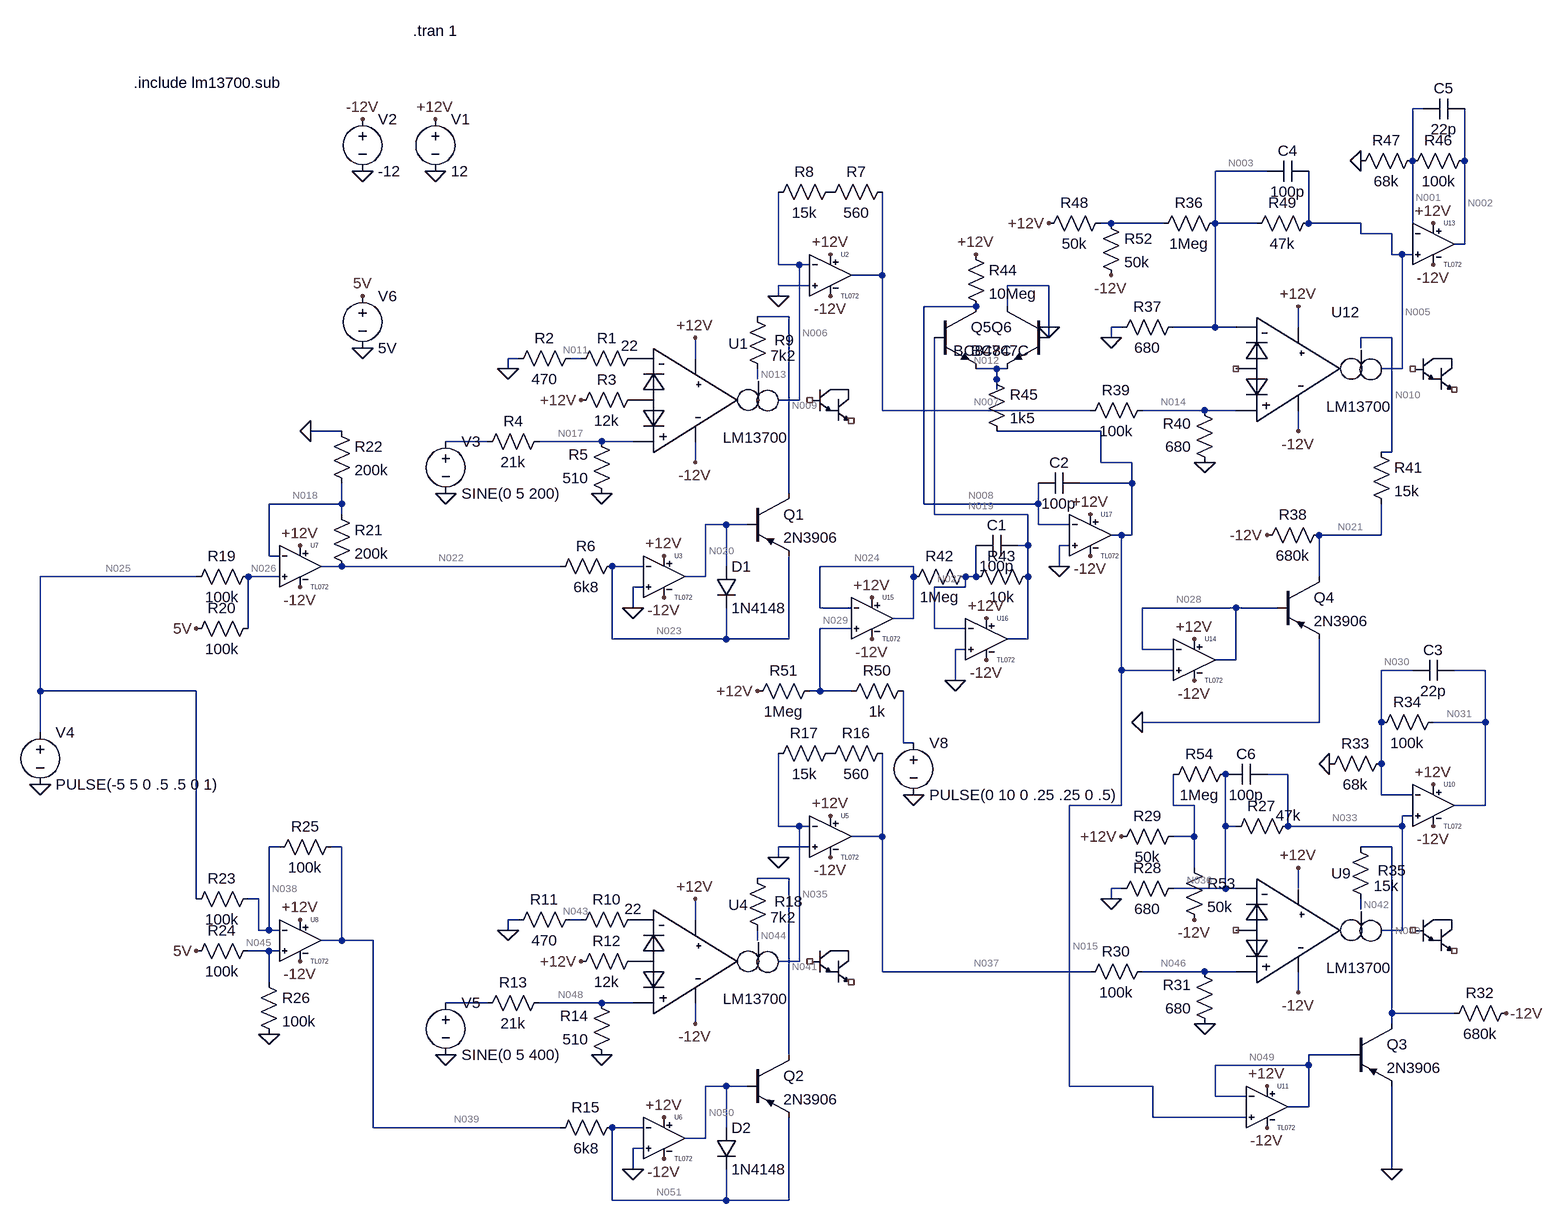
[diagram p0: schematic panner.asc]
panner.asc, the LTspice schematic file:
Version 4
SHEET 1 1880 1252
WIRE 1408 -464 1392 -464
WIRE 1392 -384 1392 -464
WIRE 1472 -384 1472 -464
WIRE 1168 -368 1088 -368
WIRE 928 -288 912 -288
WIRE 1008 -288 928 -288
WIRE 1088 -288 1088 -368
WIRE 1152 -288 1088 -288
WIRE 1232 -288 1232 -368
WIRE 1312 -288 1232 -288
WIRE 1312 -272 1312 -288
WIRE 1360 -272 1312 -272
WIRE 1392 -272 1392 -384
WIRE 1472 -256 1472 -384
WIRE 1472 -256 1456 -256
WIRE 1360 -240 1360 -272
WIRE 1376 -240 1360 -240
WIRE 1392 -240 1376 -240
WIRE 416 -224 416 -336
WIRE 448 -224 416 -224
WIRE 464 -224 448 -224
WIRE 576 -208 576 -336
WIRE 576 -208 528 -208
WIRE 464 -192 416 -192
WIRE 832 -192 768 -192
WIRE 416 -176 416 -192
WIRE 720 -160 640 -160
WIRE 768 -160 768 -192
WIRE 432 -144 384 -144
WIRE 832 -128 832 -192
WIRE 944 -128 928 -128
WIRE 1088 -128 1088 -288
WIRE 1088 -128 1024 -128
WIRE 1120 -128 1088 -128
WIRE 1216 -128 1216 -160
WIRE 832 -112 832 -128
WIRE 928 -112 928 -128
WIRE 1360 -112 1312 -112
WIRE 1312 -96 1312 -112
WIRE 16 -80 0 -80
WIRE 112 -80 96 -80
WIRE 288 -80 288 -112
WIRE 0 -64 0 -80
WIRE 752 -64 720 -64
WIRE 768 -64 752 -64
WIRE 1376 -64 1376 -240
WIRE 1376 -64 1344 -64
WIRE 384 -48 384 -64
WIRE 752 -48 752 -64
WIRE 752 -32 752 -48
WIRE 448 -16 448 -224
WIRE 448 -16 416 -16
WIRE 576 0 576 -208
WIRE 896 0 576 0
WIRE 1072 0 976 0
WIRE 1120 0 1072 0
WIRE -256 32 -304 32
WIRE 912 32 752 32
WIRE 1216 32 1216 0
WIRE -32 48 -96 48
WIRE 144 48 48 48
WIRE 192 48 144 48
WIRE 1360 64 1360 -112
WIRE 1360 64 1344 64
WIRE 288 80 288 48
WIRE 912 80 912 32
WIRE 960 80 912 80
WIRE 960 112 960 80
WIRE 960 112 880 112
WIRE 432 128 432 -144
WIRE -256 144 -256 112
WIRE -256 144 -368 144
WIRE 640 144 640 -160
WIRE 816 144 816 112
WIRE 816 144 640 144
WIRE -256 160 -256 144
WIRE 656 160 656 -112
WIRE 800 160 656 160
WIRE 336 176 304 176
WIRE 368 176 336 176
WIRE 816 176 816 144
WIRE 864 176 816 176
WIRE 944 192 928 192
WIRE 960 192 960 112
WIRE 960 192 944 192
WIRE 1344 192 1344 144
WIRE 1344 192 1248 192
WIRE 800 208 800 160
WIRE 800 208 784 208
WIRE 864 208 848 208
WIRE -368 224 -368 144
WIRE -352 224 -368 224
WIRE -256 240 -288 240
WIRE 80 240 -256 240
WIRE 208 240 160 240
WIRE 336 240 336 176
WIRE 624 240 480 240
WIRE 848 240 848 208
WIRE -480 256 -720 256
WIRE -352 256 -400 256
WIRE 304 256 304 176
WIRE 304 256 272 256
WIRE 624 256 624 240
WIRE 720 256 720 208
WIRE 720 256 704 256
WIRE 800 256 800 208
WIRE 1248 256 1248 192
WIRE 208 272 192 272
WIRE 704 272 704 256
WIRE 704 272 656 272
WIRE 192 304 192 272
WIRE 480 304 480 240
WIRE 528 304 480 304
WIRE 1120 304 976 304
WIRE 1184 304 1120 304
WIRE 624 320 624 256
WIRE 624 320 592 320
WIRE -400 336 -400 256
WIRE 528 336 480 336
WIRE 656 336 656 272
WIRE 704 336 656 336
WIRE 160 352 160 240
WIRE 336 352 336 304
WIRE 336 352 160 352
WIRE 432 352 432 224
WIRE 432 352 336 352
WIRE 800 352 800 256
WIRE 800 352 768 352
WIRE 704 368 688 368
WIRE 976 368 976 304
WIRE 1024 368 976 368
WIRE 1120 384 1120 304
WIRE 1120 384 1088 384
WIRE 944 400 944 192
WIRE 1024 400 944 400
WIRE 1392 400 1344 400
WIRE 1504 400 1456 400
WIRE 688 416 688 368
WIRE -720 432 -720 256
WIRE -480 432 -720 432
WIRE 480 432 480 336
WIRE 480 432 464 432
WIRE 528 432 480 432
WIRE 1248 480 1248 352
WIRE 1248 480 976 480
WIRE 1344 480 1344 400
WIRE 1504 480 1504 400
WIRE 1504 480 1424 480
WIRE -720 496 -720 432
WIRE 608 512 608 432
WIRE 624 512 608 512
WIRE 1344 544 1344 480
WIRE 1200 560 1168 560
WIRE 1344 592 1344 544
WIRE 1392 592 1344 592
WIRE 944 608 944 400
WIRE 944 608 864 608
WIRE 1024 608 1024 560
WIRE 1056 608 1024 608
WIRE 1504 608 1504 480
WIRE 1504 608 1456 608
WIRE 1392 624 1376 624
WIRE 416 640 416 528
WIRE 448 640 416 640
WIRE 464 640 448 640
WIRE 1104 640 1104 560
WIRE 1120 640 1104 640
WIRE 1200 640 1200 560
WIRE 1376 640 1376 624
WIRE 1376 640 1200 640
WIRE 576 656 576 528
WIRE 576 656 528 656
WIRE 1056 656 1056 608
WIRE 1056 656 1024 656
WIRE -352 672 -368 672
WIRE -256 672 -272 672
WIRE 464 672 416 672
WIRE 1360 672 1312 672
WIRE 416 688 416 672
WIRE 1056 704 1056 656
WIRE 432 720 384 720
WIRE 944 736 928 736
WIRE 1104 736 1104 640
WIRE 1104 736 1024 736
WIRE 1120 736 1104 736
WIRE 1216 736 1216 704
WIRE -480 752 -480 432
WIRE -384 752 -400 752
WIRE 928 752 928 736
WIRE 1312 768 1312 752
WIRE 16 784 0 784
WIRE 112 784 96 784
WIRE 288 784 288 752
WIRE -384 800 -384 752
WIRE -368 800 -368 672
WIRE -368 800 -384 800
WIRE -352 800 -368 800
WIRE 0 800 0 784
WIRE 1376 800 1376 640
WIRE 1376 800 1344 800
WIRE -256 816 -256 672
WIRE -256 816 -288 816
WIRE -208 816 -256 816
WIRE 384 816 384 800
WIRE -368 832 -400 832
WIRE -352 832 -368 832
WIRE 448 848 448 640
WIRE 448 848 416 848
WIRE 576 864 576 656
WIRE 896 864 576 864
WIRE 1072 864 976 864
WIRE 1120 864 1072 864
WIRE -368 880 -368 832
WIRE 1216 896 1216 864
WIRE -32 912 -96 912
WIRE 144 912 48 912
WIRE 192 912 144 912
WIRE 1360 928 1360 672
WIRE 1456 928 1360 928
WIRE 288 944 288 912
WIRE 1360 944 1360 928
WIRE 432 992 432 720
WIRE 1296 992 1232 992
WIRE 1232 1008 1232 992
WIRE 1232 1008 1088 1008
WIRE 336 1040 304 1040
WIRE 368 1040 336 1040
WIRE 864 1040 864 608
WIRE 992 1040 864 1040
WIRE 1088 1056 1088 1008
WIRE 1136 1056 1088 1056
WIRE 1232 1072 1232 1008
WIRE 1232 1072 1200 1072
WIRE 992 1088 992 1040
WIRE 1136 1088 992 1088
WIRE -208 1104 -208 816
WIRE 80 1104 -208 1104
WIRE 208 1104 160 1104
WIRE 336 1104 336 1040
WIRE 304 1120 304 1040
WIRE 304 1120 272 1120
WIRE 208 1136 192 1136
WIRE 192 1168 192 1136
WIRE 1360 1168 1360 1040
WIRE 160 1216 160 1104
WIRE 336 1216 336 1168
WIRE 336 1216 160 1216
WIRE 432 1216 432 1088
WIRE 432 1216 336 1216
FLAG -112 -368 0
FLAG -112 -448 +12V
FLAG -224 -448 -12V
FLAG -224 -368 0
FLAG 0 800 0
FLAG 112 848 +12V
FLAG 288 752 +12V
FLAG 496 624 +12V
FLAG 240 1088 +12V
FLAG 288 944 -12V
FLAG 496 688 -12V
FLAG 240 1152 -12V
FLAG -96 992 0
FLAG 144 992 0
FLAG 192 1168 0
FLAG 416 688 0
FLAG 0 -64 0
FLAG 112 -16 +12V
FLAG 288 -112 +12V
FLAG 496 -240 +12V
FLAG 240 224 +12V
FLAG 288 80 -12V
FLAG 496 -176 -12V
FLAG 240 288 -12V
FLAG -96 128 0
FLAG 144 128 0
FLAG 192 304 0
FLAG -720 576 0
FLAG 416 -176 0
FLAG -320 208 +12V
FLAG -320 272 -12V
FLAG -304 32 0
FLAG -224 -96 0
FLAG -224 -176 5V
FLAG -480 336 5V
FLAG -320 784 +12V
FLAG -320 848 -12V
FLAG -368 960 0
FLAG -480 832 5V
FLAG 928 752 0
FLAG 1216 704 +12V
FLAG 1424 576 +12V
FLAG 1168 1040 +12V
FLAG 1216 896 -12V
FLAG 1424 640 -12V
FLAG 1168 1104 -12V
FLAG 1072 944 0
FLAG 928 -112 0
FLAG 1216 -160 +12V
FLAG 1056 352 +12V
FLAG 1216 32 -12V
FLAG 1424 -224 -12V
FLAG 1056 416 -12V
FLAG 1072 80 0
FLAG 624 592 0
FLAG 1168 192 -12V
FLAG 560 288 +12V
FLAG 560 352 -12V
FLAG 736 320 +12V
FLAG 736 384 -12V
FLAG 896 160 +12V
FLAG 896 224 -12V
FLAG 832 -128 0
FLAG 720 -240 +12V
FLAG 848 240 0
FLAG 688 416 0
FLAG 976 480 0
FLAG 1424 -288 +12V
FLAG 1312 -384 0
FLAG 832 -288 +12V
FLAG 384 432 +12V
FLAG 928 -208 -12V
FLAG 1360 1168 0
FLAG 1536 928 -12V
FLAG 1264 544 0
FLAG 944 656 +12V
FLAG 1056 784 -12V
SYMBOL voltage -112 -464 R0
WINDOW 123 0 0 Left 0
WINDOW 39 0 0 Left 0
SYMATTR InstName V1
SYMATTR Value 12
SYMBOL voltage -224 -464 R0
WINDOW 123 0 0 Left 0
WINDOW 39 0 0 Left 0
SYMATTR InstName V2
SYMATTR Value -12
SYMBOL LM13700 256 768 R0
SYMATTR InstName U4
SYMBOL res 208 768 R90
WINDOW 0 0 56 VBottom 2
WINDOW 3 -16 15 VTop 2
SYMATTR InstName R10
SYMATTR Value 22
SYMBOL res 112 768 R90
WINDOW 0 0 56 VBottom 2
WINDOW 3 32 56 VTop 2
SYMATTR InstName R11
SYMATTR Value 470
SYMBOL res 208 832 R90
WINDOW 0 0 56 VBottom 2
WINDOW 3 32 56 VTop 2
SYMATTR InstName R12
SYMATTR Value 12k
SYMBOL voltage -96 896 R0
WINDOW 123 0 0 Left 0
WINDOW 39 0 0 Left 0
SYMATTR InstName V5
SYMATTR Value SINE(0 5 400)
SYMBOL res 64 896 R90
WINDOW 0 0 56 VBottom 2
WINDOW 3 32 56 VTop 2
SYMATTR InstName R13
SYMATTR Value 21k
SYMBOL res 160 1008 R180
WINDOW 0 36 76 Left 2
WINDOW 3 36 40 Left 2
SYMATTR InstName R14
SYMATTR Value 510
SYMBOL TL072 496 592 R0
SYMATTR InstName U5
SYMBOL TL072 240 1056 R0
SYMATTR InstName U6
SYMBOL res 176 1088 R90
WINDOW 0 0 56 VBottom 2
WINDOW 3 32 56 VTop 2
SYMATTR InstName R15
SYMATTR Value 6k8
SYMBOL res 592 512 R90
WINDOW 0 0 56 VBottom 2
WINDOW 3 32 56 VTop 2
SYMATTR InstName R16
SYMATTR Value 560
SYMBOL res 512 512 R90
WINDOW 0 0 56 VBottom 2
WINDOW 3 32 56 VTop 2
SYMATTR InstName R17
SYMATTR Value 15k
SYMBOL res 368 704 R0
WINDOW 0 42 52 Left 2
SYMATTR InstName R18
SYMATTR Value 7k2
SYMBOL pnp 368 992 R0
SYMATTR InstName Q2
SYMATTR Value 2N3906
SYMBOL diode 320 1104 R0
SYMATTR InstName D2
SYMATTR Value 1N4148
SYMBOL LM13700 256 -96 R0
SYMATTR InstName U1
SYMBOL res 208 -96 R90
WINDOW 0 0 56 VBottom 2
WINDOW 3 -19 21 VTop 2
SYMATTR InstName R1
SYMATTR Value 22
SYMBOL res 112 -96 R90
WINDOW 0 0 56 VBottom 2
WINDOW 3 32 56 VTop 2
SYMATTR InstName R2
SYMATTR Value 470
SYMBOL res 208 -32 R90
WINDOW 0 0 56 VBottom 2
WINDOW 3 32 56 VTop 2
SYMATTR InstName R3
SYMATTR Value 12k
SYMBOL voltage -96 32 R0
WINDOW 123 0 0 Left 0
WINDOW 39 0 0 Left 0
SYMATTR InstName V3
SYMATTR Value SINE(0 5 200)
SYMBOL res 64 32 R90
WINDOW 0 0 56 VBottom 2
WINDOW 3 32 56 VTop 2
SYMATTR InstName R4
SYMATTR Value 21k
SYMBOL res 160 144 R180
WINDOW 0 36 76 Left 2
WINDOW 3 36 40 Left 2
SYMATTR InstName R5
SYMATTR Value 510
SYMBOL TL072 496 -272 R0
SYMATTR InstName U2
SYMBOL TL072 240 192 R0
SYMATTR InstName U3
SYMBOL res 176 224 R90
WINDOW 0 0 56 VBottom 2
WINDOW 3 32 56 VTop 2
SYMATTR InstName R6
SYMATTR Value 6k8
SYMBOL res 592 -352 R90
WINDOW 0 0 56 VBottom 2
WINDOW 3 32 56 VTop 2
SYMATTR InstName R7
SYMATTR Value 560
SYMBOL res 512 -352 R90
WINDOW 0 0 56 VBottom 2
WINDOW 3 32 56 VTop 2
SYMATTR InstName R8
SYMATTR Value 15k
SYMBOL res 368 -160 R0
WINDOW 0 42 52 Left 2
SYMATTR InstName R9
SYMATTR Value 7k2
SYMBOL pnp 368 128 R0
SYMATTR InstName Q1
SYMATTR Value 2N3906
SYMBOL diode 320 240 R0
SYMATTR InstName D1
SYMATTR Value 1N4148
SYMBOL voltage -720 480 R0
WINDOW 123 0 0 Left 0
WINDOW 39 0 0 Left 0
SYMATTR InstName V4
SYMATTR Value PULSE(-5 5 0 .5 .5 0 1)
SYMBOL TL072 -320 176 R0
SYMATTR InstName U7
SYMBOL res -384 240 R90
WINDOW 0 0 56 VBottom 2
WINDOW 3 32 56 VTop 2
SYMATTR InstName R19
SYMATTR Value 100k
SYMBOL res -384 320 R90
WINDOW 0 0 56 VBottom 2
WINDOW 3 32 56 VTop 2
SYMATTR InstName R20
SYMATTR Value 100k
SYMBOL res -272 144 R0
SYMATTR InstName R21
SYMATTR Value 200k
SYMBOL res -272 16 R0
SYMATTR InstName R22
SYMATTR Value 200k
SYMBOL voltage -224 -192 R0
WINDOW 123 0 0 Left 0
WINDOW 39 0 0 Left 0
SYMATTR InstName V6
SYMATTR Value 5V
SYMBOL TL072 -320 752 R0
SYMATTR InstName U8
SYMBOL res -384 736 R90
WINDOW 0 0 56 VBottom 2
WINDOW 3 32 56 VTop 2
SYMATTR InstName R23
SYMATTR Value 100k
SYMBOL res -384 816 R90
WINDOW 0 0 56 VBottom 2
WINDOW 3 32 56 VTop 2
SYMATTR InstName R24
SYMATTR Value 100k
SYMBOL res -256 656 R90
WINDOW 0 0 56 VBottom 2
WINDOW 3 32 56 VTop 2
SYMATTR InstName R25
SYMATTR Value 100k
SYMBOL res -384 864 R0
SYMATTR InstName R26
SYMATTR Value 100k
SYMBOL LM13700 1184 720 R0
SYMATTR InstName U9
SYMBOL res 1216 624 R90
WINDOW 0 0 56 VBottom 2
WINDOW 3 -16 15 VTop 2
SYMATTR InstName R27
SYMATTR Value 47k
SYMBOL res 1040 720 R90
WINDOW 0 0 56 VBottom 2
WINDOW 3 32 56 VTop 2
SYMATTR InstName R28
SYMATTR Value 680
SYMBOL res 992 848 R90
WINDOW 0 0 56 VBottom 2
WINDOW 3 32 56 VTop 2
SYMATTR InstName R30
SYMATTR Value 100k
SYMBOL res 1088 960 R180
WINDOW 0 36 76 Left 2
WINDOW 3 36 40 Left 2
SYMATTR InstName R31
SYMATTR Value 680
SYMBOL TL072 1424 544 R0
SYMATTR InstName U10
SYMBOL TL072 1168 1008 R0
SYMATTR InstName U11
SYMBOL res 1360 528 R90
WINDOW 0 0 56 VBottom 2
WINDOW 3 32 56 VTop 2
SYMATTR InstName R33
SYMATTR Value 68k
SYMBOL res 1440 464 R90
WINDOW 0 0 56 VBottom 2
WINDOW 3 32 56 VTop 2
SYMATTR InstName R34
SYMATTR Value 100k
SYMBOL res 1296 656 R0
WINDOW 0 42 52 Left 2
SYMATTR InstName R35
SYMATTR Value 15k
SYMBOL pnp 1296 944 R0
SYMATTR InstName Q3
SYMATTR Value 2N3906
SYMBOL cap 1456 384 R90
WINDOW 0 0 32 VBottom 2
WINDOW 3 32 32 VTop 2
SYMATTR InstName C3
SYMATTR Value 22p
SYMBOL LM13700 1184 -144 R0
SYMATTR InstName U12
SYMBOL res 1040 -144 R90
WINDOW 0 0 56 VBottom 2
WINDOW 3 32 56 VTop 2
SYMATTR InstName R37
SYMATTR Value 680
SYMBOL res 992 -16 R90
WINDOW 0 0 56 VBottom 2
WINDOW 3 32 56 VTop 2
SYMATTR InstName R39
SYMATTR Value 100k
SYMBOL res 1088 96 R180
WINDOW 0 36 76 Left 2
WINDOW 3 36 40 Left 2
SYMATTR InstName R40
SYMATTR Value 680
SYMBOL TL072 1424 -320 R0
SYMATTR InstName U13
SYMBOL TL072 1056 320 R0
SYMATTR InstName U14
SYMBOL pnp 1184 256 R0
SYMATTR InstName Q4
SYMATTR Value 2N3906
SYMBOL voltage 624 496 R0
WINDOW 123 0 0 Left 0
WINDOW 39 0 0 Left 0
SYMATTR InstName V8
SYMATTR Value PULSE(0 10 0 .25 .25 0 .5)
SYMBOL res 1264 176 R90
WINDOW 0 0 56 VBottom 2
WINDOW 3 32 56 VTop 2
SYMATTR InstName R38
SYMATTR Value 680k
SYMBOL res 1328 48 R0
SYMATTR InstName R41
SYMATTR Value 15k
SYMBOL TL072 560 256 R0
SYMATTR InstName U15
SYMBOL TL072 736 288 R0
SYMATTR InstName U16
SYMBOL TL072 896 128 R0
SYMATTR InstName U17
SYMBOL res 720 240 R90
WINDOW 0 0 56 VBottom 2
WINDOW 3 32 56 VTop 2
SYMATTR InstName R42
SYMATTR Value 1Meg
SYMBOL res 816 240 R90
WINDOW 0 0 56 VBottom 2
WINDOW 3 32 56 VTop 2
SYMATTR InstName R43
SYMATTR Value 10k
SYMBOL cap 784 192 R90
WINDOW 0 0 32 VBottom 2
WINDOW 3 32 32 VTop 2
SYMATTR InstName C1
SYMATTR Value 100p
SYMBOL npn 656 -160 R0
SYMATTR InstName Q5
SYMATTR Value BC847C
SYMBOL npn 832 -160 M0
SYMATTR InstName Q6
SYMATTR Value BC847C
SYMBOL res 704 -256 R0
SYMATTR InstName R44
SYMATTR Value 10Meg
SYMBOL res 736 -64 R0
SYMATTR InstName R45
SYMATTR Value 1k5
SYMBOL cap 880 96 R90
WINDOW 0 0 32 VBottom 2
WINDOW 3 32 32 VTop 2
SYMATTR InstName C2
SYMATTR Value 100p
SYMBOL res 1488 -400 R90
WINDOW 0 0 56 VBottom 2
WINDOW 3 32 56 VTop 2
SYMATTR InstName R46
SYMATTR Value 100k
SYMBOL res 1408 -400 R90
WINDOW 0 0 56 VBottom 2
WINDOW 3 32 56 VTop 2
SYMATTR InstName R47
SYMATTR Value 68k
SYMBOL res 1104 -304 R90
WINDOW 0 0 56 VBottom 2
WINDOW 3 32 56 VTop 2
SYMATTR InstName R36
SYMATTR Value 1Meg
SYMBOL res 928 -304 R90
WINDOW 0 0 56 VBottom 2
WINDOW 3 32 56 VTop 2
SYMATTR InstName R48
SYMATTR Value 50k
SYMBOL res 1248 -304 R90
WINDOW 0 0 56 VBottom 2
WINDOW 3 32 56 VTop 2
SYMATTR InstName R49
SYMATTR Value 47k
SYMBOL cap 1232 -384 R90
WINDOW 0 0 32 VBottom 2
WINDOW 3 32 32 VTop 2
SYMATTR InstName C4
SYMATTR Value 100p
SYMBOL res 624 416 R90
WINDOW 0 0 56 VBottom 2
WINDOW 3 32 56 VTop 2
SYMATTR InstName R50
SYMATTR Value 1k
SYMBOL res 480 416 R90
WINDOW 0 0 56 VBottom 2
WINDOW 3 32 56 VTop 2
SYMATTR InstName R51
SYMATTR Value 1Meg
SYMBOL res 912 -304 R0
SYMATTR InstName R52
SYMATTR Value 50k
SYMBOL cap 1472 -480 R90
WINDOW 0 0 32 VBottom 2
WINDOW 3 32 32 VTop 2
SYMATTR InstName C5
SYMATTR Value 22p
SYMBOL res 1552 912 R90
WINDOW 0 0 56 VBottom 2
WINDOW 3 32 56 VTop 2
SYMATTR InstName R32
SYMATTR Value 680k
SYMBOL cap 1168 544 R90
WINDOW 0 0 32 VBottom 2
WINDOW 3 32 32 VTop 2
SYMATTR InstName C6
SYMATTR Value 100p
SYMBOL res 1040 640 R90
WINDOW 0 0 56 VBottom 2
WINDOW 3 32 56 VTop 2
SYMATTR InstName R29
SYMATTR Value 50k
SYMBOL res 1040 688 R0
SYMATTR InstName R53
SYMATTR Value 50k
SYMBOL res 1120 544 R90
WINDOW 0 0 56 VBottom 2
WINDOW 3 32 56 VTop 2
SYMATTR InstName R54
SYMATTR Value 1Meg
TEXT -146 -584 Left 2 !.tran 1
TEXT -576 -504 Left 2 !.include lm13700.sub

The netlist it stands for:
* panner.asc
V1 +12V 0 12
V2 -12V 0 -12
XU4 P001 N048 P002 N044 N035 +12V -12V NC_01 NC_02 LM13700 HALF13700  ; pins LIN INP INN IAB ? VCC VSS BIN BUF
R10 P002 N043 22
R11 N043 0 470
R12 P001 +12V 12k
V5 N047 0 SINE(0 5 400)
R13 N048 N047 21k
R14 0 N048 510
XU5 0 N035 +12V -12V N037 TL072  ; pins In+ In- V+ V- OUT
XU6 0 N051 +12V -12V N050 TL072  ; pins In+ In- V+ V- OUT
R15 N051 N039 6k8
R16 N037 P003 560
R17 P003 N035 15k
R18 N041 N044 7k2
Q2 N041 N050 N051 0 2N3906
D2 N050 N051 1N4148
XU1 P004 N017 P005 N013 N006 +12V -12V NC_03 NC_04 LM13700 HALF13700  ; pins LIN INP INN IAB ? VCC VSS BIN BUF
R1 P005 N011 22
R2 N011 0 470
R3 P004 +12V 12k
V3 N016 0 SINE(0 5 200)
R4 N017 N016 21k
R5 0 N017 510
XU2 0 N006 +12V -12V N007 TL072  ; pins In+ In- V+ V- OUT
XU3 0 N023 +12V -12V N020 TL072  ; pins In+ In- V+ V- OUT
R6 N023 N022 6k8
R7 N007 P006 560
R8 P006 N006 15k
R9 N009 N013 7k2
Q1 N009 N020 N023 0 2N3906
D1 N020 N023 1N4148
V4 N025 0 PULSE(-5 5 0 .5 .5 0 1)
XU7 N026 N018 +12V -12V N022 TL072  ; pins In+ In- V+ V- OUT
R19 N026 N025 100k
R20 N026 5V 100k
R21 N018 N022 200k
R22 0 N018 200k
V6 5V 0 5V
XU8 N045 N038 +12V -12V N039 TL072  ; pins In+ In- V+ V- OUT
R23 N038 N025 100k
R24 N045 5V 100k
R25 N039 N038 100k
R26 N045 0 100k
XU9 NC_05 N046 N036 N042 N033 +12V -12V NC_06 NC_07 LM13700 HALF13700  ; pins LIN INP INN IAB ? VCC VSS BIN BUF
R27 N033 N036 47k
R28 N036 0 680
R30 N046 N037 100k
R31 0 N046 680
XU10 N033 N030 +12V -12V N031 TL072  ; pins In+ In- V+ V- OUT
XU11 N015 N049 +12V -12V N049 TL072  ; pins In+ In- V+ V- OUT
R33 N030 0 68k
R34 N031 N030 100k
R35 N040 N042 15k
Q3 N040 N049 0 0 2N3906
C3 N031 N030 22p
XU12 NC_08 N014 N003 N010 N005 +12V -12V NC_09 NC_10 LM13700 HALF13700  ; pins LIN INP INN IAB ? VCC VSS BIN BUF
R37 N003 0 680
R39 N014 N007 100k
R40 0 N014 680
XU13 N005 N001 +12V -12V N002 TL072  ; pins In+ In- V+ V- OUT
XU14 N015 N028 +12V -12V N028 TL072  ; pins In+ In- V+ V- OUT
Q4 N021 N028 0 0 2N3906
V8 N032 0 PULSE(0 10 0 .25 .25 0 .5)
R38 N021 -12V 680k
R41 N010 N021 15k
XU15 N029 N024 +12V -12V N024 TL072  ; pins In+ In- V+ V- OUT
XU16 0 N027 +12V -12V N019 TL072  ; pins In+ In- V+ V- OUT
XU17 0 N008 +12V -12V N015 TL072  ; pins In+ In- V+ V- OUT
R42 N027 N024 1Meg
R43 N019 N027 10k
C1 N019 N027 100p
Q5 N008 N019 N012 0 BC847C
Q6 0 0 N012 0 BC847C
R44 +12V N008 10Meg
R45 N012 N015 1k5
C2 N015 N008 100p
R46 N002 N001 100k
R47 N001 0 68k
R36 N003 N004 1Meg
R48 N004 +12V 50k
R49 N005 N003 47k
C4 N005 N003 100p
R50 N032 N029 1k
R51 N029 +12V 1Meg
R52 N004 -12V 50k
C5 N002 N001 22p
R32 -12V N040 680k
C6 N033 N036 100p
R29 N034 +12V 50k
R53 N034 -12V 50k
R54 N036 N034 1Meg
.model D D
.lib standard.dio
.model NPN NPN
.model PNP PNP
.lib standard.bjt
.tran 1
.include lm13700.sub
.lib TL072.sub
.backanno
.end

* Results of the author's LTspice run, read from the files saved beside the schematic
* Operating Point, zero values left out:
*   V(+12v) = 12 V
*   V(-12v) = -12 V
*   V(n044) = -10.25 V
*   V(p002) = 223.5 mV
*   V(n048) = 223.8 mV
*   V(p001) = 1.071 V
*   V(n035) = 10.87 µV
*   V(n043) = 213.5 mV
*   V(n037) = 22.09 mV
*   V(n050) = -669.6 mV
*   V(n051) = 13.96 µV
*   V(n039) = 10 V
*   V(p003) = 21.3 mV
*   V(n041) = -56.69 mV
*   V(n013) = -11.29 V
*   V(p005) = 225.2 mV
*   V(n017) = 225.5 mV
*   V(p004) = 1.072 V
*   V(n006) = 10.97 µV
*   V(n011) = 215.1 mV
*   V(n007) = 11.78 µV
*   V(n020) = -85.09 mV
*   V(n023) = 11.34 µV
*   V(n022) = 26.15 µV
*   V(p006) = 11.75 µV
*   V(n009) = -11.29 V
*   V(n025) = -5 V
*   V(n018) = 8.868 µV
*   V(n026) = -2.103 µV
*   V(5v) = 5 V
*   V(n038) = 2.5 V
*   V(n045) = 2.5 V
*   V(n042) = -11.6 V
*   V(n036) = -31.76 nV
*   V(n046) = 149.2 µV
*   V(n033) = -2.477 µV
*   V(n031) = 25.19 µV
*   V(n030) = 8.494 µV
*   V(n049) = -459.8 mV
*   V(n015) = -459.8 mV
*   V(n040) = -11.6 V
*   V(n010) = -11.6 V
*   V(n003) = -31.76 nV
*   V(n014) = 83.16 nV
*   V(n005) = -2.477 µV
*   V(n002) = 25.19 µV
*   V(n001) = 8.494 µV
*   V(n028) = -459.8 mV
*   V(n021) = -11.6 V
*   V(n024) = 12 mV
*   V(n029) = 11.99 mV
*   V(n019) = -108.5 µV
*   V(n027) = 10.97 µV
*   V(n008) = 12.98 µV
*   V(n012) = -456.2 mV
*   Ic(Q6) = 1.205 µA
*   Ib(Q6) = 2.766 nA
*   Ie(Q6) = -1.208 µA
*   Ic(Q5) = 1.2 µA
*   Ib(Q5) = 2.755 nA
*   Ie(Q5) = -1.203 µA
*   Ic(Q4) = -583.7 nA
*   Ib(Q4) = -2.615 nA
*   Ie(Q4) = 586.3 nA
*   Ic(Q3) = -583.7 nA
*   Ib(Q3) = -2.615 nA
*   Ie(Q3) = 586.3 nA
*   Ic(Q1) = -11.49 pA
*   Ib(Q1) = 11.12 pA
*   Ic(Q2) = -1.415 mA
*   Ib(Q2) = -55.34 µA
*   Ie(Q2) = 1.471 mA
*   I(D1) = -2.135 nA
*   I(D2) = -2.521 nA
*   I(R53) = 240 µA
*   I(R29) = -240 µA
*   I(R32) = -583.7 nA
*   I(R52) = 240 µA
*   I(R51) = -11.99 µA
*   I(R50) = -11.99 µA
*   I(R49) = -52.03 pA
*   I(R48) = -240 µA
*   I(R47) = 124.9 pA
*   I(R46) = 167 pA
*   I(R45) = 2.411 µA
*   I(R44) = 1.2 µA
*   I(R43) = -11.95 nA
*   I(R42) = -11.99 nA
*   I(R41) = 22.3 pA
*   I(R38) = 583.7 nA
*   I(R40) = -122.3 pA
*   I(R39) = -117 pA
*   I(R37) = -46.71 pA
*   I(R35) = -22.3 pA
*   I(R34) = 167 pA
*   I(R33) = 124.9 pA
*   I(R31) = -219.4 nA
*   I(R30) = -219.4 nA
*   I(R28) = -46.7 pA
*   I(R27) = -52.03 pA
*   I(R26) = 25 µA
*   I(R25) = 75 µA
*   I(R24) = -25 µA
*   I(R23) = 75 µA
*   I(R22) = -44.34 pA
*   I(R21) = -86.39 pA
*   I(R20) = -50 µA
*   I(R19) = 50 µA
*   I(R9) = 11.51 pA
*   I(R8) = 52.04 pA
*   I(R7) = 52.04 pA
*   I(R6) = -2.177 nA
*   I(R5) = -442.2 µA
*   I(R4) = 10.74 µA
*   I(R3) = -910.6 µA
*   I(R2) = 457.7 µA
*   I(R1) = 457.7 µA
*   I(R18) = 1.415 mA
*   I(R17) = 1.419 µA
*   I(R16) = 1.419 µA
*   I(R15) = -1.471 mA
*   I(R14) = -438.8 µA
*   I(R13) = 10.66 µA
*   I(R12) = -910.8 µA
*   I(R11) = 454.3 µA
*   I(R10) = 454.3 µA
*   I(V8) = 11.99 µA
*   I(V6) = -75 µA
*   I(V4) = 125 µA
*   I(V3) = 10.74 µA
*   I(V5) = 10.66 µA
*   I(V2) = 152.8 mA
*   I(V1) = -153.2 mA